# EAGLE design untitled (EAGLE 9.3.2)
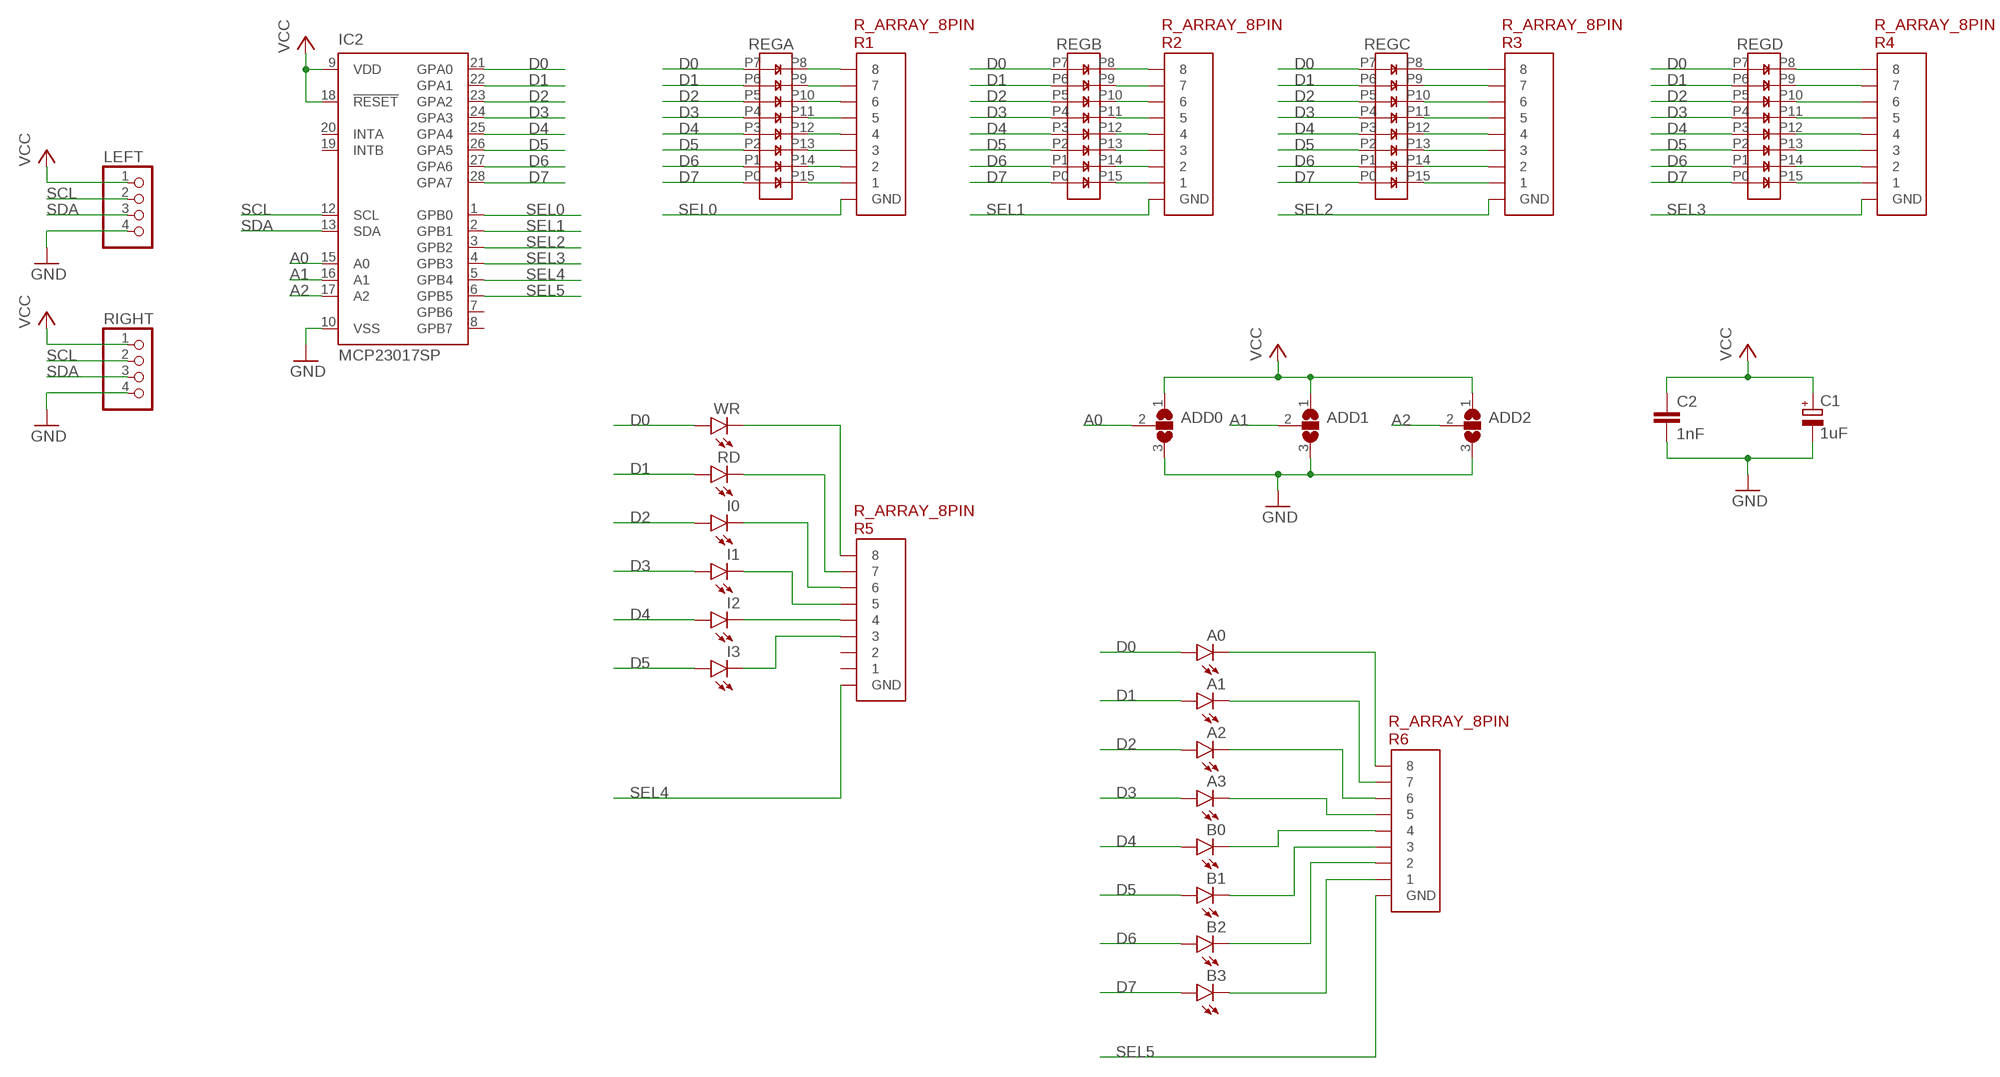
[diagram p0: schematic, sheet 1]

## Parts
A0  LED3MM  [LED3MM]
A1  LED3MM  [LED3MM]
A2  LED3MM  [LED3MM]
A3  LED3MM  [LED3MM]
ADD0  SJ2W  [SJ_2]
ADD1  SJ2W  [SJ_2]
ADD2  SJ2W  [SJ_2]
B0  LED3MM  [LED3MM]
B1  LED3MM  [LED3MM]
B2  LED3MM  [LED3MM]
B3  LED3MM  [LED3MM]
C1  1uF  CPOL-EUE2.5-6  [E2,5-6]
C2  1nF  C2.5/2  [C2.5-2]
I0  LED3MM  [LED3MM]
I1  LED3MM  [LED3MM]
I2  LED3MM  [LED3MM]
I3  LED3MM  [LED3MM]
IC2  MCP23017SP  [DIL28-3]
LEFT  PINHD-1X4  [1X04]
R1  R_ARRAY_8PIN  [R_ARRAY_8PIN]
R2  R_ARRAY_8PIN  [R_ARRAY_8PIN]
R3  R_ARRAY_8PIN  [R_ARRAY_8PIN]
R4  R_ARRAY_8PIN  [R_ARRAY_8PIN]
R5  R_ARRAY_8PIN  [R_ARRAY_8PIN]
R6  R_ARRAY_8PIN  [R_ARRAY_8PIN]
RD  LED3MM  [LED3MM]
REGA  LB8  [LB8]
REGB  LB8  [LB8]
REGC  LB8  [LB8]
REGD  LB8  [LB8]
RIGHT  PINHD-1X4  [1X04]
WR  LED3MM  [LED3MM]

## Nets
A0: ADD0.2 IC2.15(A0)
A1: ADD1.2 IC2.16(A1)
A2: ADD2.2 IC2.17(A2)
D0: A0.A IC2.21(GPA0) REGA.P7 REGB.P7 REGC.P7 REGD.P7 WR.A
D1: A1.A IC2.22(GPA1) RD.A REGA.P6 REGB.P6 REGC.P6 REGD.P6
D2: A2.A I0.A IC2.23(GPA2) REGA.P5 REGB.P5 REGC.P5 REGD.P5
D3: A3.A I1.A IC2.24(GPA3) REGA.P4 REGB.P4 REGC.P4 REGD.P4
D4: B0.A I2.A IC2.25(GPA4) REGA.P3 REGB.P3 REGC.P3 REGD.P3
D5: B1.A I3.A IC2.26(GPA5) REGA.P2 REGB.P2 REGC.P2 REGD.P2
D6: B2.A IC2.27(GPA6) REGA.P1 REGB.P1 REGC.P1 REGD.P1
D7: B3.A IC2.28(GPA7) REGA.P0 REGB.P0 REGC.P0 REGD.P0
GND: ADD0.3 ADD1.3 ADD2.3 C1.- C2.2 IC2.10(VSS) LEFT.4 RIGHT.4
N$1: R3.8 REGC.P8
N$2: R3.7 REGC.P9
N$3: R3.6 REGC.P10
N$4: R3.5 REGC.P11
N$5: R3.4 REGC.P12
N$6: R3.3 REGC.P13
N$7: R3.2 REGC.P14
N$8: R3.1 REGC.P15
N$9: R5.8 WR.K(C)
N$10: R5.7 RD.K(C)
N$11: I0.K(C) R5.6
N$12: I1.K(C) R5.5
N$13: I2.K(C) R5.4
N$14: I3.K(C) R5.3
N$17: R1.8 REGA.P8
N$18: R1.7 REGA.P9
N$19: R1.6 REGA.P10
N$20: R1.5 REGA.P11
N$21: R1.4 REGA.P12
N$22: R1.3 REGA.P13
N$23: R1.2 REGA.P14
N$24: R1.1 REGA.P15
N$25: R2.8 REGB.P8
N$26: R2.7 REGB.P9
N$27: R2.6 REGB.P10
N$28: R2.5 REGB.P11
N$29: R2.4 REGB.P12
N$30: R2.3 REGB.P13
N$31: R2.2 REGB.P14
N$32: R2.1 REGB.P15
N$33: A0.K(C) R6.8
N$34: A1.K(C) R6.7
N$35: A2.K(C) R6.6
N$36: A3.K(C) R6.5
N$37: R4.8 REGD.P8
N$38: R4.7 REGD.P9
N$39: R4.6 REGD.P10
N$40: R4.5 REGD.P11
N$41: R4.4 REGD.P12
N$42: R4.3 REGD.P13
N$43: R4.2 REGD.P14
N$44: R4.1 REGD.P15
N$45: B0.K(C) R6.4
N$46: B1.K(C) R6.3
N$47: B2.K(C) R6.2
N$48: B3.K(C) R6.1
SCL: IC2.12(SCL) LEFT.2 RIGHT.2
SDA: IC2.13(SDA) LEFT.3 RIGHT.3
SEL0: IC2.1(GPB0) R1.GND
SEL1: IC2.2(GPB1) R2.GND
SEL2: IC2.3(GPB2) R3.GND
SEL3: IC2.4(GPB3) R4.GND
SEL4: IC2.5(GPB4) R5.GND
SEL5: IC2.6(GPB5) R6.GND
VCC: ADD0.1 ADD1.1 ADD2.1 C1.+ C2.1 IC2.9(VDD) IC2.18(!RESET) LEFT.1 RIGHT.1
Unconnected: IC2.7(GPB6) IC2.8(GPB7) IC2.19(INTB) IC2.20(INTA) R5.1 R5.2

## Library data of the parts
A0 A1-A3 B0 B1-B3 I0 I1-I3 RD WR = led:LED: LED OSRAM: - CHIPLED LG R971, LG N971, LY N971, LG Q971, LY Q971, LO R971, LY R971 LH N974, LH R974 LS Q976, LO Q976, LY Q976 LO Q996 - Hyper CHIPLED LW Q18S LB Q993, LB Q99A, LB R99A - SideLED LS A670, LO A670, LY A670, LG A670, LP A670 LB A673, LV A673, LT A673, LW A673 LH A674 LY A675 LS A676, LA A676, LO A676, LY A676, LW A676 LS A679, LY A679, LG A679 - Hyper Micro SIDELED® LS Y876, LA Y876, LO Y876, LY Y876 LT Y87S - SmartLED LW L88C, LW L88S LB L89C, LB L89S, LG L890 LS L89K, LO L89K, LY L89K LS L896, LA L896, LO L896, LY L896 - TOPLED LS T670, LO T670, LY T670, LG T670, LP T670 LSG T670, LSP T670, LSY T670, LOP T670, LYG T670 LG T671, LOG T671, LSG T671 LB T673, LV T673, LT T673, LW T673 LH T674 LS T676, LA T676, LO T676, LY T676, LB T676, LH T676, LSB T676, LW T676 LB T67C, LV T67C, LT T67C, LS T67K, LO T67K, LY T67K, LW E67C LS E67B, LA E67B, LO E67B, LY E67B, LB E67C, LV E67C, LT E67C LW T67C LS T679, LY T679, LG T679 LS T770, LO T770, LY T770, LG T770, LP T770 LB T773, LV T773, LT T773, LW T773 LH T774 LS E675, LA E675, LY E675, LS T675 LS T776, LA T776, LO T776, LY T776, LB T776 LHGB T686 LT T68C, LB T68C - Hyper Mini TOPLED® LB M676 - Mini TOPLED Santana® LG M470 LS M47K, LO M47K, LY M47K Source: http://www.osram.convergy.de LUXEON: - LUMILED® LXK2-PW12-R00, LXK2-PW12-S00, LXK2-PW14-U00, LXK2-PW14-V00 LXK2-PM12-R00, LXK2-PM12-S00, LXK2-PM14-U00 LXK2-PE12-Q00, LXK2-PE12-R00, LXK2-PE12-S00, LXK2-PE14-T00, LXK2-PE14-U00 LXK2-PB12-K00, LXK2-PB12-L00, LXK2-PB12-M00, LXK2-PB14-N00, LXK2-PB14-P00, LXK2-PB14-Q00 LXK2-PR12-L00, LXK2-PR12-M00, LXK2-PR14-Q00, LXK2-PR14-R00 LXK2-PD12-Q00, LXK2-PD12-R00, LXK2-PD12-S00 LXK2-PH12-R00, LXK2-PH12-S00 LXK2-PL12-P00, LXK2-PL12-Q00, LXK2-PL12-R00 Source: www.luxeon.com KINGBRIGHT: KA-3528ASYC Source: www.kingbright.com
ADD0 ADD1 ADD2 = jumper:SJ2W: SMD solder JUMPER
C1 = rcl:CPOL-EU: POLARIZED CAPACITOR, European symbol; SPICEPREFIX: C
C2 = capacitor-wima:C: CAPACITOR naming: grid - package width
IC2 = microchip:MCP23017: http://ww1.microchip.com/downloads/en/DeviceDoc/21952a.pdf Source: http://ww1.microchip.com/downloads/en/DeviceDoc/21952a.pdf; MF: MICROCHIP; MPN: MCP23017-E/SP; OC_FARNELL: 1332088; OC_NEWARK: 31K2959
LEFT RIGHT = pinhead:PINHD-1X4: PIN HEADER
R1-R6 = 8bit_components:R_ARRAY_8PIN
REGA REGB REGC REGD = 8bit_components:LB8

## Board
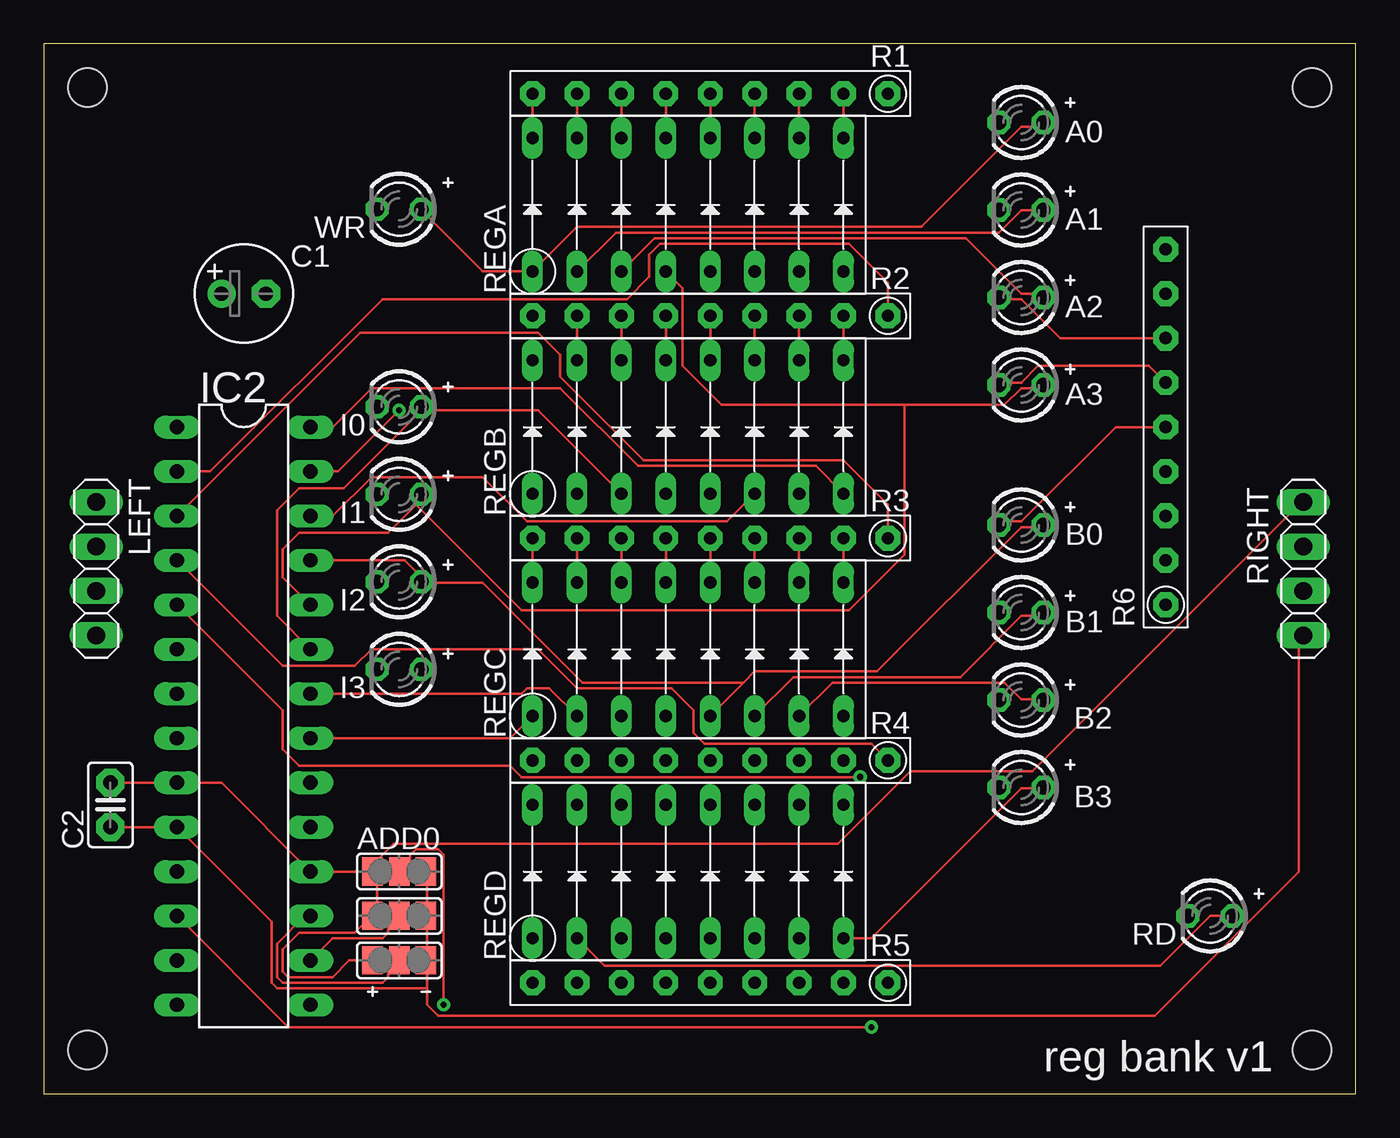
[diagram p1: board, top side]
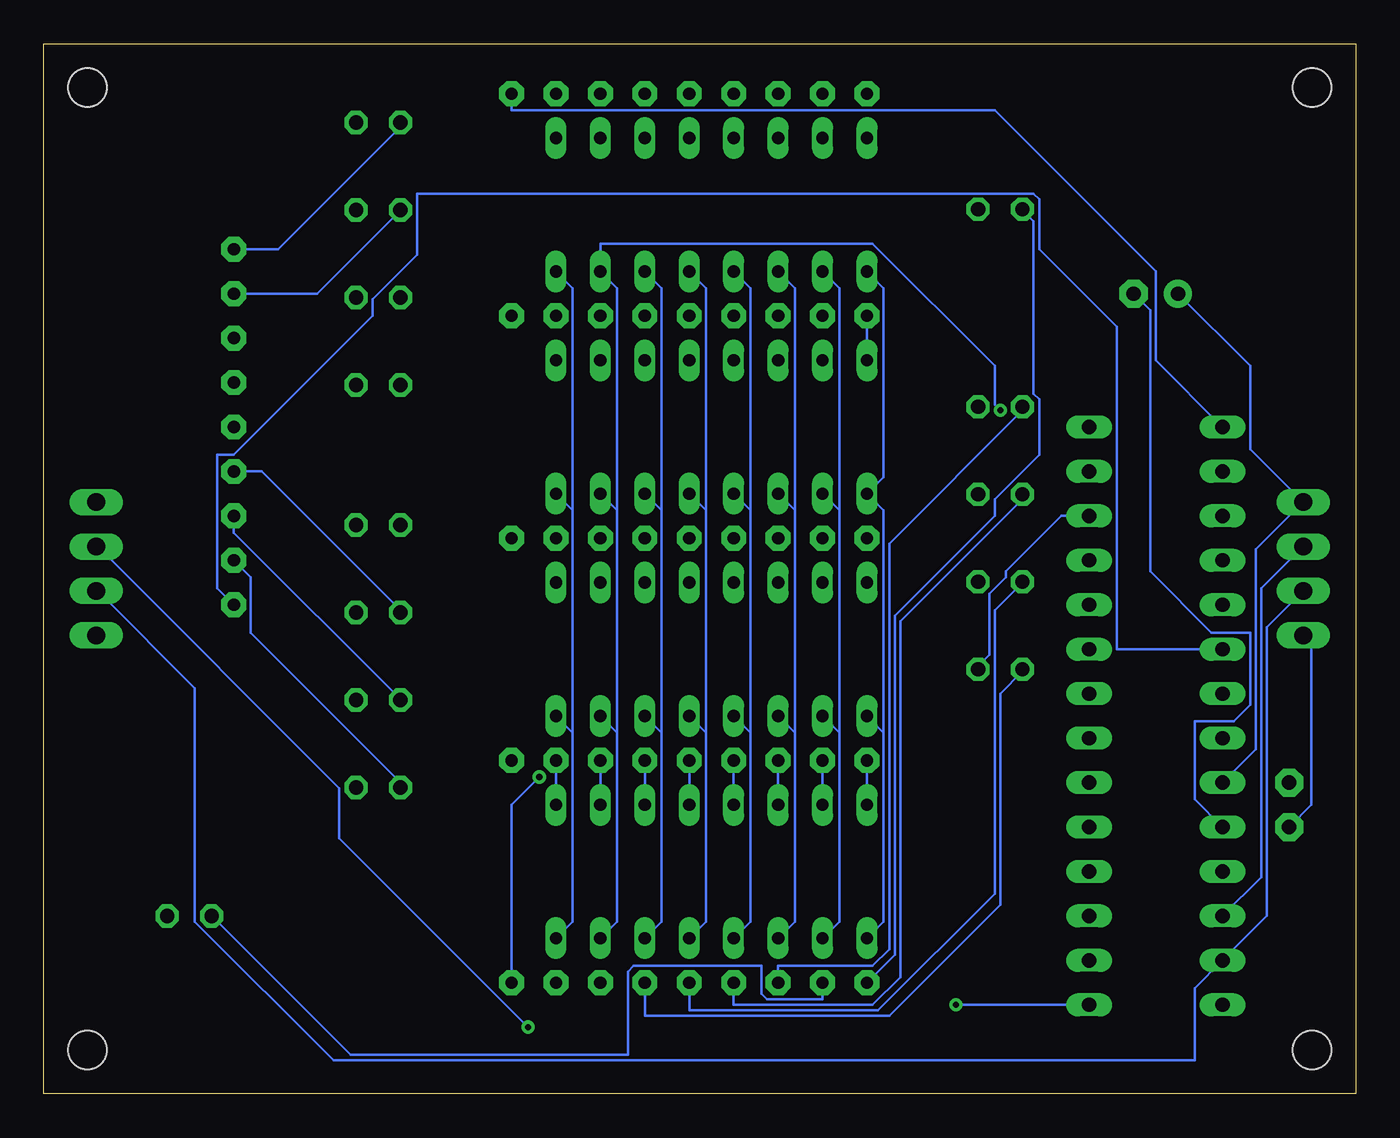
[diagram p2: board, bottom side, seen from below]

Size 75 x 60 mm. Coordinates in mm from the lower left corner, seen from the top.
Outline: 0,0 75,0 75,60 0,60 0,0
Copper layers (1*16): Top 0.035mm / dielectric 1.5mm / Bottom 0.035mm
Design rules "default": minimum track width 6mil, minimum drill 0.35mm, track to track 6mil, track to pad 6mil, pad to pad 6mil, via to via 6mil, smd to smd 6mil, copper to edge 40mil, drill to drill 6mil, minimum pad ring 10mil, minimum via ring 8mil, stop-mask expansion 4mil, vias tented up to drill 0mil, thermal gap 10mil
Holes 2.2 mm at 2.5,57.5 72.5,57.5 72.5,2.5 2.5,2.5
vRestrict: area 17.3,5.6 to 23.4,14.7

### Footprints (pad centres in the part's own frame; a part is rotated, then mirrored left to right if it is on the bottom)
LED3MM = drill 0.813 octagon: A -1.27,0; K 1.27,0
SJ_2 = smd 1.168 x 1.6: 1 -1.524,0; 2 0,0; 3 1.524,0
E2,5-6 = drill 0.813 pad 1.6: + -1.27,0 | drill 0.813 pad 1.6 octagon: - 1.27,0
C2.5-2 = drill 0.813 pad 1.6 octagon: 1 -1.27,0; 2 1.27,0
DIL28-3 = drill 0.813 long: 1 -16.51,-3.81; 2 -13.97,-3.81; 3 -11.43,-3.81; 4 -8.89,-3.81; 5 -6.35,-3.81; 6 -3.81,-3.81; 7 -1.27,-3.81; 8 1.27,-3.81; 9 3.81,-3.81; 10 6.35,-3.81; 11 8.89,-3.81; 12 11.43,-3.81; 13 13.97,-3.81; 14 16.51,-3.81; 15 16.51,3.81; 16 13.97,3.81; 17 11.43,3.81; 18 8.89,3.81; 19 6.35,3.81; 20 3.81,3.81; 21 1.27,3.81; 22 -1.27,3.81; 23 -3.81,3.81; 24 -6.35,3.81; 25 -8.89,3.81; 26 -11.43,3.81; 27 -13.97,3.81; 28 -16.51,3.81
1X04 = drill 1.016 long: 1 -3.81,0; 2 -1.27,0; 3 1.27,0; 4 3.81,0
R_ARRAY_8PIN = drill 0.7 pad 1.422 octagon: 1 0,-7.62; 2 0,-5.08; 3 0,-2.54; 4 0,0; 5 0,2.54; 6 0,5.08; 7 0,7.62; 8 0,10.16; GND 0,-10.16
LB8 = drill 0.7 long: P0 -3.81,-8.89; P1 -3.81,-6.35; P2 -3.81,-3.81; P3 -3.81,-1.27; P4 -3.81,1.27; P5 -3.81,3.81; P6 -3.81,6.35; P7 -3.81,8.89; P8 3.81,8.89; P9 3.81,6.35; P10 3.81,3.81; P11 3.81,1.27; P12 3.81,-1.27; P13 3.81,-3.81; P14 3.81,-6.35; P15 3.81,-8.89

### Placement (x,y rotation side)
A0  55.88,55.5 180 top
A1  55.88,50.5 180 top
A2  55.88,45.5 180 top
A3  55.88,40.5 180 top
ADD0  20.32,12.7 0 top
ADD1  20.32,10.16 0 top
ADD2  20.32,7.62 0 top
B0  55.88,32.5 180 top
B1  55.88,27.5 180 top
B2  55.88,22.5 180 top
B3  55.88,17.5 180 top
C1  11.43,45.72 0 top
C2  3.81,16.51 270 top
I0  20.32,39.25 180 top
I1  20.32,34.25 180 top
I2  20.32,29.25 180 top
I3  20.32,24.25 180 top
IC2  11.43,21.59 270 top
LEFT  3,30 270 top
R1  38.1,57.15 90 top
R2  38.1,44.45 90 top
R3  38.1,31.75 90 top
R4  38.1,19.05 90 top
R5  38.1,6.35 90 top
R6  64.14,38.1 0 top
RD  66.67,10.16 180 top
REGA  36.83,50.8 90 top
REGB  36.83,38.1 90 top
REGC  36.83,25.4 90 top
REGD  36.83,12.7 90 top
RIGHT  72,30 270 top
WR  20.32,50.55 180 top

### Tracks (layer width: path | path; a pad name or v marks a point on that pad's centre or on a via)
A0  (via drill 0.35)
  Top 0.152: ADD0.2 20.95,13.34 20.95,13.65 21.27,13.97 22.54,13.97 22.86,13.65 v22.86,5.08
  Bottom 0.152: IC2.15 v22.86,5.08
A1
  Top 0.152: ADD1.2 19.68,9.53 19.68,9.21 19.37,8.89 16.51,8.89 IC2.16
A2
  Top 0.152: ADD2.2 19.68,6.99 19.68,6.67 19.37,6.35 13.65,6.35 13.34,6.67 13.34,8.57 14.92,10.16 IC2.17
D0
  Top 0.152: IC2.21 26.67,20.32 REGC.P7 | WR.A 21.59,50.48 25.08,46.99 REGA.P7 30.48,49.53 50.16,49.53 55.88,55.24 57.15,55.24 A0.A
  Bottom 0.152: REGD.P7 26.99,9.84 26.99,20.64 | REGC.P7 26.99,20.64 | 26.99,20.64 26.99,33.34 REGB.P7 26.99,35.24 26.99,46.04 REGA.P7
D1
  Top 0.152: IC2.22 27.3,22.86 27.62,23.18 28.89,23.18 REGC.P6 | RD.A 66.67,10.16 63.82,7.3 32.07,7.3 REGD.P6 | REGA.P6 32.7,49.21 54.61,49.21 55.88,50.48 57.15,50.48 A1.A
  Bottom 0.152: REGD.P6 29.53,9.84 29.53,20.64 | REGC.P6 29.53,20.64 | 29.53,33.34 REGB.P6 | 29.53,20.64 29.53,33.34 | REGA.P6 29.53,46.04 29.53,33.34
D2
  Top 0.152: IC2.23 13.34,27.3 13.34,33.34 14.61,34.61 17.14,34.61 21.59,39.05 | REGA.P5 34.92,48.9 52.7,48.9 55.88,45.72 57.15,45.72 A2.A | 21.59,39.05 28.26,39.05 REGB.P5 | 21.59,39.05 I0.A
  Bottom 0.152: REGD.P5 32.07,9.84 32.07,20.64 | REGC.P5 32.07,20.64 | 32.07,33.34 REGB.P5 | 32.07,20.64 32.07,33.34 | REGA.P5 32.07,46.04 32.07,33.34
D3
  Top 0.152: IC2.24 13.65,29.53 13.65,31.11 14.61,32.07 19.68,32.07 21.27,33.66 | 21.27,33.66 21.59,33.97 I1.A 21.27,33.66 | 49.21,39.37 38.73,39.37 36.51,41.59 36.51,46.04 REGA.P4 | 49.21,39.37 54.93,39.37 55.88,40.32 57.15,40.32 A3.A | 21.27,33.66 27.3,27.62 46.04,27.62 49.21,30.8 49.21,39.37
  Bottom 0.152: REGD.P4 34.61,9.84 34.61,20.64 | REGC.P4 34.61,20.64 | 34.61,33.34 REGB.P4 | 34.61,20.64 34.61,33.34 | REGA.P4 34.61,46.04 34.61,33.34
D4
  Top 0.152: IC2.25 20.64,30.48 21.59,29.53 I2.A 21.59,29.21 25.08,29.21 30.8,23.5 40.01,23.5 | REGC.P3 40.01,23.5 | 40.01,23.5 40.64,24.13 47.62,24.13 55.88,32.38 57.15,32.38 B0.A
  Bottom 0.152: REGD.P3 37.15,9.84 37.15,20.64 | REGC.P3 37.15,20.64 | 37.15,33.34 REGB.P3 | 37.15,20.64 37.15,33.34 | REGA.P3 37.15,46.04 37.15,33.34
D5
  Top 0.152: REGC.P2 42.86,23.81 52.39,23.81 55.88,27.3 57.15,27.3 B1.A | IC2.26 16.51,33.02 18.73,35.24 25.08,35.24 27.62,32.7 39.05,32.7 REGB.P2
  Bottom 0.152: IC2.26 16.83,33.02 20,29.84 20,29.53 20.95,28.57 20.95,25.08 21.59,24.45 I3.A | REGD.P2 39.69,9.84 39.69,20.64 | REGC.P2 39.69,20.64 | 39.69,33.34 REGB.P2 | 39.69,20.64 39.69,33.34 | REGA.P2 39.69,46.04 39.69,33.34
D6  (via drill 0.35)
  Top 0.152: IC2.27 16.83,35.56 v20.32,39.05 | REGC.P1 45.09,23.5 54.93,23.5 55.88,22.54 57.15,22.54 B2.A
  Bottom 0.152: REGD.P1 42.23,9.84 42.23,20.64 | REGC.P1 42.23,20.64 | 42.23,33.34 REGB.P1 | 42.23,20.64 42.23,33.34 | 42.23,33.34 42.23,46.04 REGA.P1 43.18,48.58 27.62,48.58 20.64,41.59 20.64,39.37 v20.32,39.05
D7
  Top 0.152: IC2.28 16.51,38.1 18.73,40.32 29.53,40.32 33.97,35.88 44.13,35.88 REGB.P0 | REGD.P0 47.31,8.89 55.88,17.46 57.15,17.46 B3.A
  Bottom 0.152: REGD.P0 44.77,9.84 44.77,20.64 | REGC.P0 44.77,20.64 | 44.77,33.34 REGB.P0 | 44.77,20.64 44.77,33.34 | REGA.P0 44.77,46.04 44.77,33.34
GND
  Top 0.152: C2.2 IC2.10 13.02,9.84 13.02,6.35 13.34,6.03 21.91,6.03 | 21.91,10.16 21.91,7.62 | 21.91,10.16 21.91,12.7 ADD0.3 | 21.91,10.16 ADD1.3 | 21.91,7.62 21.91,6.03 | 21.91,6.03 21.91,5.08 22.54,4.45 63.5,4.45 71.75,12.7 71.75,26.04 RIGHT.4 | 21.91,7.62 ADD2.3
  Bottom 0.152: C2.2 2.54,16.51 2.54,25.72 2.86,26.04 LEFT.4 | C1.- 11.75,44.77 11.75,29.84 8.26,26.35 6.03,26.35 6.03,22.23 6.99,21.27 9.21,21.27 9.21,16.83 IC2.10
N$1
  Top 0.152: R3.8 REGC.P8
N$2
  Top 0.152: R3.7 REGC.P9
N$3
  Top 0.152: R3.6 REGC.P10
N$4
  Top 0.152: R3.5 REGC.P11
N$5
  Top 0.152: R3.4 REGC.P12
N$6
  Top 0.152: R3.3 REGC.P13
N$7
  Top 0.152: R3.2 REGC.P14
N$8
  Top 0.152: R3.1 REGC.P15
N$9
  Bottom 0.152: R5.8 26.35,7.94 26.35,27.3 20.64,33.02 20.64,33.97 18.1,36.51 18.1,39.69 18.41,40.01 18.41,49.85 19.05,50.48 WR.K
N$10
  Bottom 0.152: RD.K 57.47,2.22 41.59,2.22 41.59,6.99 41.27,7.3 33.97,7.3 33.97,5.71 33.66,5.4 30.48,5.4 R5.7
N$11
  Bottom 0.152: R5.6 33.02,7.3 27.62,7.3 26.67,8.26 26.67,31.43 19.05,39.05 I0.K
N$12
  Bottom 0.152: R5.5 35.56,5.08 27.62,5.08 26.04,6.67 26.04,26.99 19.05,33.97 I1.K
N$13
  Bottom 0.152: R5.4 38.1,4.76 27.3,4.76 20.64,11.43 20.64,27.62 19.05,29.21 I2.K
N$14
  Bottom 0.152: R5.3 40.64,4.45 26.67,4.45 20.32,10.79 20.32,22.86 19.05,24.13 I3.K
N$17
  Top 0.152: R1.8 REGA.P8
N$18
  Top 0.152: R1.7 REGA.P9
N$19
  Top 0.152: R1.6 REGA.P10
N$20
  Top 0.152: R1.5 REGA.P11
N$21
  Top 0.152: R1.4 REGA.P12
N$22
  Top 0.152: R1.3 REGA.P13
N$23
  Top 0.152: R1.2 REGA.P14
N$24
  Top 0.152: R1.1 REGA.P15
N$25
  Bottom 0.152: R2.8 REGB.P8
N$26
  Top 0.152: R2.7 REGB.P9
N$27
  Top 0.152: R2.6 REGB.P10
N$28
  Top 0.152: R2.5 REGB.P11
N$29
  Top 0.152: R2.4 REGB.P12
N$30
  Top 0.152: R2.3 REGB.P13
N$31
  Top 0.152: R2.2 REGB.P14
N$32
  Top 0.152: R2.1 REGB.P15
N$33
  Bottom 0.152: R6.8 61.59,48.26 54.61,55.24 A0.K
N$34
  Bottom 0.152: R6.7 59.37,45.72 54.61,50.48 A1.K
N$35
  Top 0.152: R6.6 58.1,43.18 55.88,45.4 54.61,45.4 A2.K
N$36
  Top 0.152: R6.5 63.18,41.59 56.83,41.59 55.88,40.64 54.61,40.64 A3.K
N$37
  Bottom 0.152: R4.8 REGD.P8
N$38
  Bottom 0.152: R4.7 REGD.P9
N$39
  Bottom 0.152: R4.6 REGD.P10
N$40
  Bottom 0.152: R4.5 REGD.P11
N$41
  Bottom 0.152: R4.4 REGD.P12
N$42
  Bottom 0.152: R4.3 REGD.P13
N$43
  Bottom 0.152: R4.2 REGD.P14
N$44
  Bottom 0.152: R4.1 REGD.P15
N$45
  Top 0.152: R6.4 61.28,38.1 55.88,32.7 54.61,32.7 B0.K
N$46
  Bottom 0.152: R6.3 62.55,35.56 54.61,27.62 B1.K
N$47
  Bottom 0.152: R6.2 64.14,32.07 54.61,22.54 B2.K
N$48
  Bottom 0.152: R6.1 63.18,29.53 63.18,26.35 54.61,17.78 B3.K
SCL  (via drill 0.35)
  Top 0.152: v47.31,3.81 13.97,3.81 IC2.12
  Bottom 0.152: IC2.12 5.4,12.38 5.4,28.89 3.17,31.11 LEFT.2 | v47.31,3.81 58.1,14.61 58.1,17.46 71.75,31.11 RIGHT.2
SDA
  Bottom 0.152: LEFT.3 3.17,28.57 5.08,26.67 5.08,10.16 IC2.13 9.21,6.03 9.21,1.91 58.42,1.91 66.36,9.84 66.36,23.18 71.75,28.57 RIGHT.3
SEL0
  Bottom 0.152: IC2.1 11.43,41.91 11.43,46.99 20.64,56.2 48.26,56.2 R1.GND
SEL1
  Top 0.152: IC2.2 9.53,35.56 19.37,45.4 33.34,45.4 34.61,46.67 34.61,47.94 35.24,48.58 46.04,48.58 48.26,46.35 R2.GND
SEL2
  Top 0.152: IC2.3 18.1,43.5 28.26,43.5 29.53,42.23 29.53,40.96 34.29,36.2 45.72,36.2 48.26,33.66 R3.GND
SEL3
  Top 0.152: IC2.4 13.65,24.45 17.78,24.45 18.73,25.4 28.26,25.4 30.48,23.18 35.88,23.18 37.15,21.91 37.15,20.64 37.78,20 47.31,20 R4.GND
SEL4  (via drill 0.35)
  Top 0.152: IC2.5 13.65,21.91 13.65,19.68 14.61,18.73 26.67,18.73 27.3,18.1 v46.67,18.1
  Bottom 0.152: v46.67,18.1 48.26,16.51 R5.GND
SEL5
  Bottom 0.152: IC2.6 13.65,25.4 13.65,43.81 18.1,48.26 18.1,51.12 18.41,51.44 53.66,51.44 53.66,47.94 56.2,45.4 56.2,44.45 64.14,36.51 65.09,36.51 65.09,28.89 R6.GND
VCC
  Top 0.152: C2.1 IC2.9 10.16,17.78 IC2.18 18.41,12.7 | ADD2.1 17.46,7.62 16.51,6.67 13.97,6.67 13.65,6.99 13.65,8.26 14.61,9.21 17.78,9.21 18.73,10.16 ADD1.1 19.05,10.16 19.05,12.7 ADD0.1 | ADD0.1 18.41,12.7 | 18.41,12.7 20,14.29 45.4,14.29 49.53,18.41 56.52,18.41 71.75,33.66 RIGHT.1 | 18.73,12.7 ADD0.1
  Bottom 0.152: C1.+ 6.03,41.59 6.03,36.83 3.17,33.97 LEFT.1 3.17,33.66 5.71,31.11 5.71,19.68 IC2.9

### Text on the board
tPlace: reg bank v1